# Altium project ECE453-F22-MCU.PrjPcb (part 3 of 3)

## Sheet 06-Lightsensor.SchDoc
size A
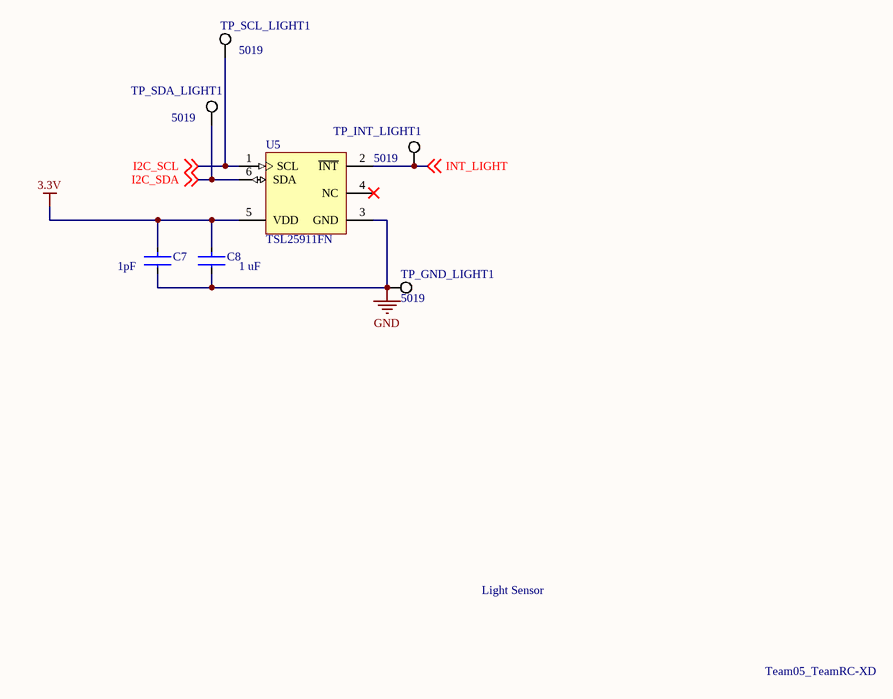
[diagram p4: 06-Lightsensor.SchDoc]

### Parts
C7  Capacitance: 1pF  [FP-CC0805-0_1-0_7-IPC_B]  (hidden comment: CC0805BRNPO9BN1R0)
C8  value 1 uF  [FP-CC0805-0_85-MFG]  (hidden comment: CC0805KKX7R6BB105)
TP_GND_LIGHT1  5019  [KSTN-5019_V]
TP_INT_LIGHT1  5019  [KSTN-5019_V]
TP_SCL_LIGHT1  5019  [KSTN-5019_V]
TP_SDA_LIGHT1  5019  [KSTN-5019_V]
U5  TSL25911FN  [AMS-FN-6-2400X2000DE_V]

### Nets
3.3V: C7.1 C8.1 U5.5(VDD)
GND: C7.2 C8.2 TP_GND_LIGHT1.1 U5.3(GND)
I2C_SCL: TP_SCL_LIGHT1.1 U5.1(SCL) ; off-sheet I2C_SCL
I2C_SDA: TP_SDA_LIGHT1.1 U5.6(SDA) ; off-sheet I2C_SDA
INT_LIGHT: TP_INT_LIGHT1.1 U5.2(~{INT}) ; off-sheet INT_LIGHT

Not connected (* = marked no-connect by the designer): U5 4(NC)*

### Notes on the sheet
- Light Sensor
- Team05_TeamRC-XD

### Library data of the parts
C7 = CMP-03422-001522-1: CAP CER 1PF 50V C0G/NPO 0805; Manufacturer: Yageo; Dielectric: C0G; Case Code (Imperial): 0805; Max Operating Temperature: 125°C; Packaging: Tape and Reel; Min Operating Temperature: -55°C; Weight: 0.000194oz; Resistor Type: Ceramic; Voltage Rating: 50V; Thickness: 0.028inch; Width: 0.049inch; Termination: SMD/SMT; RoHS Compliant: Yes; Length: 0.079inch; Voltage Rating (DC): 50V; Mount: Surface Mount; Height: 0.6mm; Case/Package: 0805; Series: CC; Case Code (Metric): 2012; Depth: 1.25mm; Supplier 1: Digi-Key; Supplier Part Number 1: 311-4124-6-ND; Manufacturer Part Number: CC0805BRNPO9BN1R0; RoHS: Yes; Category: Ceramic Capacitors; Stock 1: 21580; Pricing 1: 1=0.15000, 10=0.10900, 50=0.06180, 100=0.05120, 500=0.03592, 1000=0.02974 (USD); ComponentLink1URL: http://www.mouser.com/ds/2/447/Yageo_UPY-GP_NP0_16V-to-50V_9-358835.pdf?src-supplier=Mouser; ComponentLink1Description: http://www.mouser.com/ds/2/447/Yageo_UPY-GP_NP0_16V-to-50V_9-358835.pdf?src-supplier=Mouser; ComponentLink2URL: https://www.yageo.com/upload/media/product/productsearch/datasheet/mlcc/UPY-GP_NP0_16V-to-50V_18.pdf?src-supplier=Digi-Key; ComponentLink2Description: https://www.yageo.com/upload/media/product/productsearch/datasheet/mlcc/UPY-GP_NP0_16V-to-50V_18.pdf?src-supplier=Digi-Key; ComponentLink3URL: http://www.yageo.com/documents/recent/UPY-GP_NP0_16V-to-50V_16.pdf?src-supplier=Digi-Key; ComponentLink3Description: http://www.yageo.com/documents/recent/UPY-GP_NP0_16V-to-50V_16.pdf?src-supplier=Digi-Key; ComponentLink4URL: http://www.yageo.com/documents/recent/UPY-GP_NP0_16V-to-50V_8.pdf?src-supplier=Avnet; ComponentLink4Description: http://www.yageo.com/documents/recent/UPY-GP_NP0_16V-to-50V_8.pdf?src-supplier=Avnet; ComponentLink5URL: http://www.yageo.com/exep/pages/download/literatures/ProductSelectionGuide%202014_Final_2.pdf?src-supplier=Digi-Key; ComponentLink5Description: http://www.yageo.com/exep/pages/download/literatures/ProductSelectionGuide%202014_Final_2.pdf?src-supplier=Digi-Key
C8 = CMP-03422-000182-1: CAP CER 1UF 10V X7R 0805; Manufacturer: Yageo; Material: Ceramic; Tolerance: 0.1; ComponentLink2URL: http://www.yageo.com/documents/recent/UPY-GPHC_Y5V_6.3V-to-50V_8.pdf; Automotive: No; Temperature Range Low: -30°C; Octopart: https://octopart.com/cc0805kkx7r6bb105-yageo-42522859; Temperature Characteristic: X7R; RoHS: TRUE; Voltage Rating: 10 V; Capacitance: 1 uF; Package: CC0805-0.85; Device Class L3: Ceramic Capacitors; Category: Cap; Mouser Description: Multilayer Ceramic Capacitors MLCC - SMD/SMT 1.0uF 10V X7R 10%; Temperature Range High: +85°C; Ipc Land Pattern Name: CAPC200125X85; Manufacturer Part Number: CC0805KKX7R6BB105; ComponentLink2Description: Datasheet; Temperature: -30°C to +85°C; Height: 0.95mm; Lead Free: Yes; Device Class L1: Passive Components; Device Class L2: Capacitors; Footprint Url: http://www.yageo.com/exep/pages/download/literatures/UPY-C_GEN_24.pdf; Digikey Description: CAP CER 1UF 10V X7R 0805; Supplier 1: Digi-Key; Supplier Part Number 1: 311-1458-2-ND; Stock 1: 126000; Pricing 1: 3000=0.02620, 6000=0.02397, 9000=0.02230, 15000=0.02119, 30000=0.02007, 75000=0.01840 (USD); Mount: Surface Mount; Case/Package: 0805; Number of Pins: 2; Case Code (Imperial): 0805; Case Code (Metric): 2012; Dielectric Material: Ceramic; Min Operating Temperature: -55°C; Max Operating Temperature: 125°C; Dielectric: X7R; Voltage Rating (DC): 10V; Packaging: Tape and Reel; Package Quantity: 1; Termination: SMD/SMT; Resistor Type: Ceramic; Series: CC; Length: 2mm; Width: 1.25mm; Thickness: 0.057inch; Depth: 1.25mm; Radiation Hardening: No; REACH SVHC: Unknown; Halogen Free: Halogen Free; RoHS Compliant: Yes; ComponentLink1URL: https://datasheet.ciiva.com/7978/1489800-7978199.pdf?src-supplier=Element14; ComponentLink1Description: https://datasheet.ciiva.com/7978/1489800-7978199.pdf?src-supplier=Element14; ComponentLink3URL: https://datasheet.ciiva.com/28450/1489800-28450742.pdf?src-supplier=Element14; ComponentLink3Description: https://datasheet.ciiva.com/28450/1489800-28450742.pdf?src-supplier=Element14; ComponentLink4URL: https://datasheet.ciiva.com/46430/1734573-46430165.pdf?src-supplier=Element14; ComponentLink4Description: https://datasheet.ciiva.com/46430/1734573-46430165.pdf?src-supplier=Element14; ComponentLink5URL: https://datasheet.ciiva.com/176/mlccorderingcode-176908.pdf?src-supplier=Digi-Key; ComponentLink5Description: https://datasheet.ciiva.com/176/mlccorderingcode-176908.pdf?src-supplier=Digi-Key; ComponentLink6URL: https://datasheet.ciiva.com/176/mlccorderingcode-176907.pdf?src-supplier=Digi-Key; ComponentLink6Description: https://datasheet.ciiva.com/176/mlccorderingcode-176907.pdf?src-supplier=Digi-Key; ComponentLink7URL: https://datasheet.ciiva.com/176/mlccorderingcode-176909.pdf?src-supplier=Digi-Key; ComponentLink7Description: https://datasheet.ciiva.com/176/mlccorderingcode-176909.pdf?src-supplier=Digi-Key; ComponentLink8URL: https://datasheet.ciiva.com/8033/1489800-8033973.pdf?src-supplier=Element14; ComponentLink8Description: https://datasheet.ciiva.com/8033/1489800-8033973.pdf?src-supplier=Element14; ComponentLink9URL: https://datasheet.ciiva.com/8033/1489800-8033998.pdf?src-supplier=Element14; ComponentLink9Description: https://datasheet.ciiva.com/8033/1489800-8033998.pdf?src-supplier=Element14; ComponentLink10URL: https://datasheet.ciiva.com/13389/upy-gp-np0-16v-to-50v-8-13389349.pdf?src-supplier=Mouser; ComponentLink10Description: https://datasheet.ciiva.com/13389/upy-gp-np0-16v-to-50v-8-13389349.pdf?src-supplier=Mouser; ComponentLink11URL: https://datasheet.ciiva.com/11583/upy-gphc-x7r-6-3v-to-50v-8-11583596.pdf?src-supplier=Avnet; ComponentLink11Description: https://datasheet.ciiva.com/11583/upy-gphc-x7r-6-3v-to-50v-8-11583596.pdf?src-supplier=Avnet
TP_GND_LIGHT1 TP_INT_LIGHT1 TP_SCL_LIGHT1 TP_SDA_LIGHT1 = CMP-1672-00008-1: Test Point, 1 Position SMD, RoHS, Tape and Reel; Manufacturer: Keystone Electronics; ComponentLink1Description: Manufacturer URL; Package Quantity: 1000; DatasheetVersion: 03/2014; Packaging: Tape and Reel; ComponentLink2URL: http://www.keyelco.com/product-pdf.cfm?p=1357; ComponentLink1URL: http://www.keyelco.com/; Mount: Surface Mount; Contact Plating: Silver; PackageDescription: 1-Pin Surface Mount Device, Body 3.81 x 2.03 mm; Pins: 1; RoHSCompliant: True; Mounting Technology: Surface Mount; ComponentLink2Description: Datasheet; PackageReference: 5019; Supplier 1: Digi-Key; Supplier Part Number 1: 36-5019CT-ND; Manufacturer Part Number: 5019; RoHS: Yes; Category: Connectors; Stock 1: 1293364; Pricing 1: 1=0.34000, 25=0.27360, 100=0.22340, 250=0.20064, 500=0.19152 (USD); Number of Pins: 1; Material: Bronze; Contact Material: Bronze; Termination: SMD/SMT; Series: 5019; Height: 0.09inch; REACH SVHC: No SVHC; RoHS Compliant: Yes; Lead Free: Lead Free; ComponentLink3URL: https://datasheet.ciiva.com/16318/m60-2p61-16318395.pdf?src-supplier=Future+Electronics; ComponentLink3Description: https://datasheet.ciiva.com/16318/m60-2p61-16318395.pdf?src-supplier=Future+Electronics; ComponentLink4URL: https://datasheet.ciiva.com/16885/70182998-16885945.pdf?src-supplier=Allied+Electronics; ComponentLink4Description: https://datasheet.ciiva.com/16885/70182998-16885945.pdf?src-supplier=Allied+Electronics; ComponentLink5URL: https://datasheet.ciiva.com/14848/m60-2p61-14848437.pdf?src-supplier=Digi-Key; ComponentLink5Description: https://datasheet.ciiva.com/14848/m60-2p61-14848437.pdf?src-supplier=Digi-Key; ComponentLink6URL: https://datasheet.ciiva.com/14848/m60-2p61-14848438.pdf?src-supplier=Digi-Key; ComponentLink6Description: https://datasheet.ciiva.com/14848/m60-2p61-14848438.pdf?src-supplier=Digi-Key; ComponentLink7URL: https://datasheet.ciiva.com/14848/m60-2p61-14848439.pdf?src-supplier=Digi-Key; ComponentLink7Description: https://datasheet.ciiva.com/14848/m60-2p61-14848439.pdf?src-supplier=Digi-Key
U5 = CMP-0865-00001-1: Light-to-Digital Converter with I2C Interface, 2.7 to 3.6 V, -30 to 70 degC, FN-6, Pb-Free, Reel; Manufacturer: AMS; Interface: I2C - Vdd; Supply Voltage (V): 2.7 - 3.6; Maximum Lux: 88K; Programmable: Gain, Integration Time, Interrupt; Wavelength: 850nm; Data Bus Width: 16b; Max Frequency: 400kHz; Operating Supply Voltage: 3V; ComponentLink2Description: Datasheet; ComponentLink1URL: www.ams.com; Mounting Technology: Surface Mount; PackageReference: FN-6; PackageVersion: TAOS059Q, 11/2009; ComponentLink2URL: http://www.ams.com/eng/content/download/389383/1251117/221235; PartNumber: TSL25911FN; PackageDescription: 6-Pin Dual Flat No-Lead, 2.4 x 2 mm Body, 0.65 mm Pitch; ComponentLink1Description: Manufacturer URL; Supplier 1: Avnet; Supplier Part Number 1: 300150004; Manufacturer Part Number: TSL25911FN; RoHS: Yes; Category: Optical Sensors; Stock 1: 3500; Pricing 1: 3500=1.00640, 7000=0.97920, 14000=0.95200, 21000=0.92480, 28000=0.89760, 35000=0.87040, 350000=0.84320 (USD); Case/Package: WFDFN; Number of Pins: 6; Min Operating Temperature: -30°C; Max Operating Temperature: 70°C; Packaging: Tape and Reel; Package Quantity: 1; Output Type: I2C; Lead Free: Lead Free; RoHS Compliant: Yes; ComponentLink3URL: https://datasheet.ciiva.com/18495/tsl25911-datasheet-en-v1-18495162.pdf?src-supplier=Digi-Key; ComponentLink3Description: https://datasheet.ciiva.com/18495/tsl25911-datasheet-en-v1-18495162.pdf?src-supplier=Digi-Key; ComponentLink4URL: https://datasheet.ciiva.com/26985/tsl2591-v163-5-253098-26985860.pdf?src-supplier=Mouser; ComponentLink4Description: https://datasheet.ciiva.com/26985/tsl2591-v163-5-253098-26985860.pdf?src-supplier=Mouser; ComponentLink5URL: https://datasheet.ciiva.com/26993/tsl25911fn-26993335.pdf?src-supplier=Future+Electronics; ComponentLink5Description: https://datasheet.ciiva.com/26993/tsl25911fn-26993335.pdf?src-supplier=Future+Electronics; ComponentLink6URL: https://datasheet.ciiva.com/18495/tsl2591-datasheet-en-v2-18495163.pdf?src-supplier=Digi-Key; ComponentLink6Description: https://datasheet.ciiva.com/18495/tsl2591-datasheet-en-v2-18495163.pdf?src-supplier=Digi-Key; ComponentLink7URL: https://datasheet.ciiva.com/18495/tsl2591-datasheet-en-v2-18495164.pdf?src-supplier=Digi-Key; ComponentLink7Description: https://datasheet.ciiva.com/18495/tsl2591-datasheet-en-v2-18495164.pdf?src-supplier=Digi-Key

## Sheet 03-Accelerometer_new.SchDoc
size A
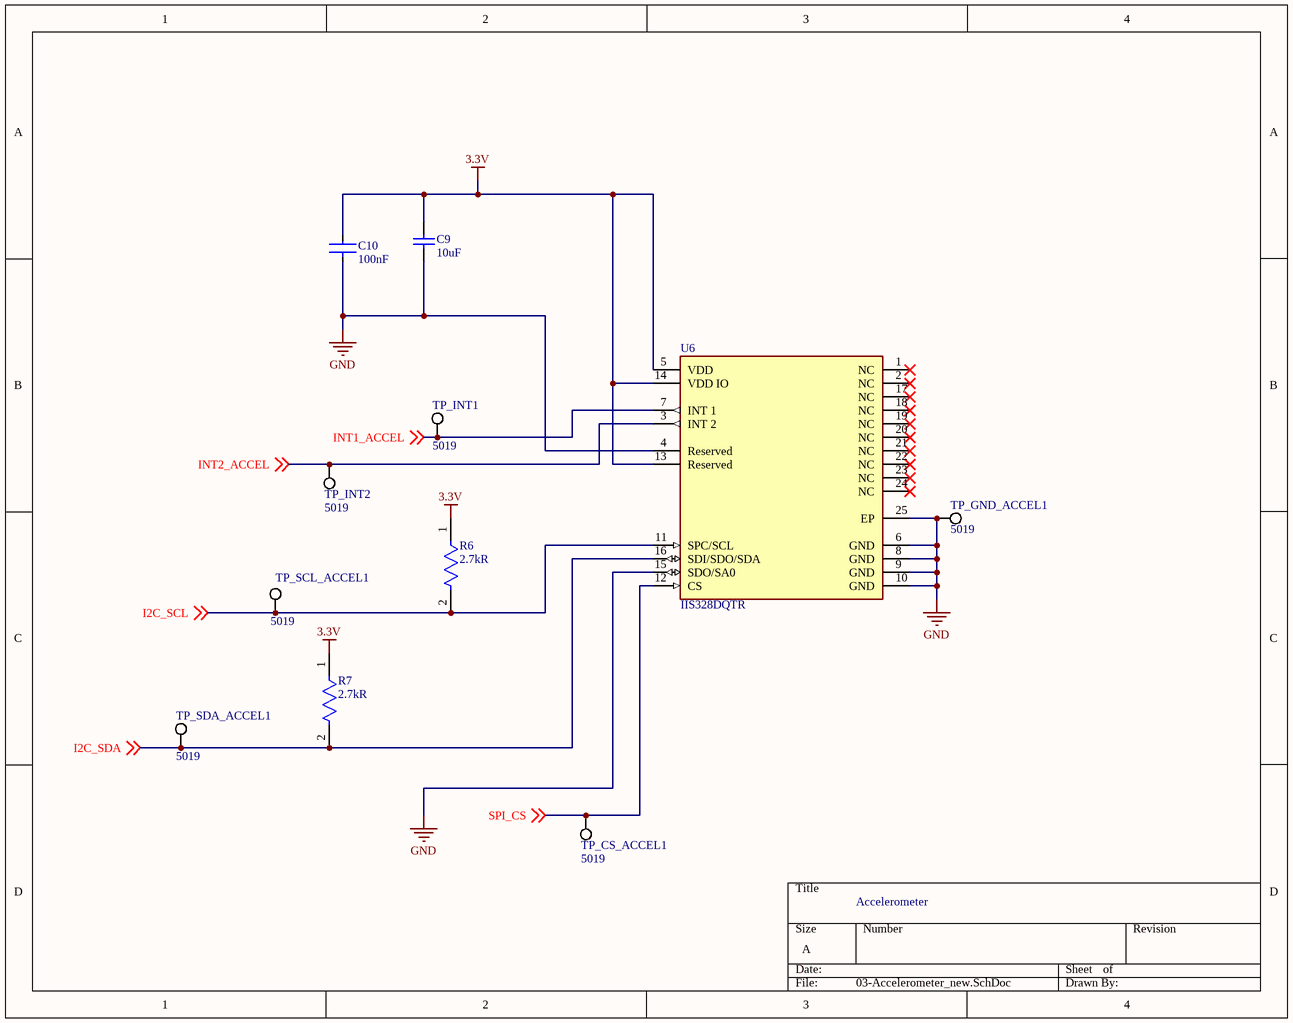
[diagram p5: 03-Accelerometer_new.SchDoc]

### Parts
C9  Capacitance: 10uF  [CAPC2014X150X70LL20]  (hidden comment: TACR106M006RTA)
C10  Capacitance: 100nF  [FP-C2012-125-0_2-MFG]  (hidden comment: C2012X8R1H104K125AA)
R6  Resistance: 2.7kR  [FP-RMCF0805-MFG]  (hidden comment: RMCF0805JT2K70)
R7  Resistance: 2.7kR  [FP-RMCF0805-MFG]  (hidden comment: RMCF0805JT2K70)
TP_CS_ACCEL1  5019  [KSTN-5019_V]
TP_GND_ACCEL1  5019  [KSTN-5019_V]
TP_INT1  5019  [KSTN-5019_V]
TP_INT2  5019  [KSTN-5019_V]
TP_SCL_ACCEL1  5019  [KSTN-5019_V]
TP_SDA_ACCEL1  5019  [KSTN-5019_V]
U6  IIS328DQTR  [FP-IIS328DQTR-MFG]

### Nets
3.3V: C9.1 C10.2 R6.1 R7.1 U6.5(VDD) U6.13(Reserved) U6.14(VDD_IO)
GND: C9.2 C10.1 TP_GND_ACCEL1.1 U6.4(Reserved) U6.6(GND) U6.8(GND) U6.9(GND) U6.10(GND) U6.15(SDO/SA0) U6.25(EP)
I2C_SCL: R6.2 TP_SCL_ACCEL1.1 U6.11(SPC/SCL) ; off-sheet I2C_SCL
I2C_SDA: R7.2 TP_SDA_ACCEL1.1 U6.16(SDI/SDO/SDA) ; off-sheet I2C_SDA
INT1_ACCEL: TP_INT1.1 U6.7(INT_1) ; off-sheet INT1_ACCEL
INT2_ACCEL: TP_INT2.1 U6.3(INT_2) ; off-sheet INT2_ACCEL
SPI_CS: TP_CS_ACCEL1.1 U6.12(CS) ; off-sheet SPI_CS

Not connected (* = marked no-connect by the designer): U6 1(NC)* 2(NC)* 17(NC)* 18(NC)* 19(NC)* 20(NC)* 21(NC)* 22(NC)* 23(NC)* 24(NC)*

### Notes on the sheet
- Accelerometer

### Library data of the parts
C9 = CMP-2007-00024-1: 10 uF Capacitor; Manufacturer: AVX Interconnect / Elco; Dielectric Material: Tantalum; ESR (Equivalent Series Resistance): 5R; Voltage Rating: 6.3V; Tolerance: 20%; Leakage Current: 600nA; Polarity: Polar; Dissipation Factor: 8%; Part Number: TACR106M006RTA; Supplier 1: Digi-Key; Supplier Part Number 1: 478-5225-1-ND; Manufacturer Part Number: TACR106M006RTA; RoHS: Yes; Category: Tantalum Capacitors; Stock 1: 10884; Pricing 1: 1=1.80000, 10=1.45800, 50=1.27280, 100=1.11370, 500=0.84850, 1000=0.74245 (USD); Mount: Surface Mount,PCB; Case/Package: 0805; Number of Pins: 2; Case Code (Imperial): 0805; Case Code (Metric): 2012; Min Operating Temperature: -55°C; Max Operating Temperature: 125°C; Package Quantity: 1; Packaging: Tape and Reel; Voltage Rating (DC): 6.3V; Termination: SMD/SMT; Voltage: 6.3V; Features: General Purpose; Series: TAC; Construction: Flat; Length: 2mm; Width: 1.35mm; Height: 1.35mm; Height - Seated (Max): 0.059inch; Depth: 1.35mm; Lead Pitch: 0.7mm; Radiation Hardening: No; Lead Free: Lead Free; RoHS Compliant: Yes; ComponentLink1URL: https://datasheet.ciiva.com/265/tac-265075.pdf?src-supplier=Digi-Key; ComponentLink1Description: https://datasheet.ciiva.com/265/tac-265075.pdf?src-supplier=Digi-Key; ComponentLink2URL: https://datasheet.ciiva.com/265/tac-265076.pdf?src-supplier=Digi-Key; ComponentLink2Description: https://datasheet.ciiva.com/265/tac-265076.pdf?src-supplier=Digi-Key; ComponentLink3URL: https://datasheet.ciiva.com/265/tac-265077.pdf?src-supplier=Digi-Key; ComponentLink3Description: https://datasheet.ciiva.com/265/tac-265077.pdf?src-supplier=Digi-Key; ComponentLink4URL: https://datasheet.ciiva.com/11244/tac-11244488.pdf?src-supplier=Avnet; ComponentLink4Description: https://datasheet.ciiva.com/11244/tac-11244488.pdf?src-supplier=Avnet; ComponentLink5URL: https://datasheet.ciiva.com/14592/70001310-14592936.pdf?src-supplier=Allied+Electronics; ComponentLink5Description: https://datasheet.ciiva.com/14592/70001310-14592936.pdf?src-supplier=Allied+Electronics
C10 = CMP-08246-005122-1: Multilayer Ceramic Capacitors 100nF ±10% 50V X8R SMD 0805; Manufacturer: TDK; Case/Package: 0805; Dielectric: X8R; Case Code (Metric): 2012; Height: 1.25mm; REACH SVHC: No SVHC; Series: C; Voltage Rating (DC): 50V; Tolerance: 10%; Depth: 1.25mm; Voltage Rating: 50V; Thickness: 0.057inch; RoHS Compliant: Yes; Termination: SMD/SMT; Weight: 0.000194oz; Width: 0.049inch; Mount: Surface Mount; Max Operating Temperature: 150°C; Features: High Temperature; Min Operating Temperature: -55°C; Lead Free: Lead Free; Packaging: Tape and Reel; Resistor Type: Ceramic; Case Code (Imperial): 0805; Package Quantity: 1; Length: 2mm; Supplier 1: Digi-Key; Supplier Part Number 1: 445-2514-6-ND; Manufacturer Part Number: C2012X8R1H104K125AA; RoHS: Yes; Category: Ceramic Capacitors; Stock 1: 681639; Pricing 1: 1=0.18000, 10=0.12600, 50=0.07160, 100=0.05930, 500=0.04158, 1000=0.03443 (USD); Reach SVHC Compliant: No SVHC; ComponentLink1URL: https://datasheet.ciiva.com/24216/c2012x8r1h104k125aa-265043-24216015.pdf?src-supplier=Mouser; ComponentLink1Description: https://datasheet.ciiva.com/24216/c2012x8r1h104k125aa-265043-24216015.pdf?src-supplier=Mouser; ComponentLink2URL: https://datasheet.ciiva.com/28451/1833282-28451948.pdf?src-supplier=Element14; ComponentLink2Description: https://datasheet.ciiva.com/28451/1833282-28451948.pdf?src-supplier=Element14; ComponentLink3URL: https://datasheet.ciiva.com/22719/1833282-22719557.pdf?src-supplier=Element14; ComponentLink3Description: https://datasheet.ciiva.com/22719/1833282-22719557.pdf?src-supplier=Element14; ComponentLink4URL: https://datasheet.ciiva.com/46384/e417-c-46384149.pdf?src-supplier=Element14; ComponentLink4Description: https://datasheet.ciiva.com/46384/e417-c-46384149.pdf?src-supplier=Element14
R6 R7 = CMP-26527-006669-1: 2.7kΩ ±5% 0.125W 0805 Thick Film Chip Resistor AEC-Q200 compliant; Manufacturer: Stackpole Electronics; Temperature Coefficient: 100ppm/°C; Max Power Dissipation: 125mW; Depth: 1.25mm; Length: 0.079inch; Size Code: 0805; RoHS Compliant: Yes; Mount: Surface Mount; Contact Plating: Tin; Construction: Rectangular; Height: 0.026inch; Number of Terminations: 2; Lead Free: Lead Free; Case Code (Metric): 2012; Radiation Hardening: No; Width: 0.049inch; Max Operating Temperature: 155°C; Series: RMCF; Power Rating: 125mW; Military Standard: Not; Resistor Type: Thick Film; Package Quantity: 1; Tolerance: 5%; Features: Automotive AEC-Q200; Packaging: Tape and Reel; Min Operating Temperature: -55°C; Case/Package: 0805; Case Code (Imperial): 0805; Supplier 1: Digi-Key; Supplier Part Number 1: RMCF0805JT2K70CT-ND; Manufacturer Part Number: RMCF0805JT2K70; RoHS: Yes; Category: Chip SMD Resistors; Stock 1: 162420; Pricing 1: 1=0.10000, 10=0.01800, 100=0.00730, 1000=0.00328, 2500=0.00284 (USD); ComponentLink1URL: https://datasheet.ciiva.com/26946/getdatasheetpartid-362051-26946720.pdf?src-supplier=Verical; ComponentLink1Description: https://datasheet.ciiva.com/26946/getdatasheetpartid-362051-26946720.pdf?src-supplier=Verical
TP_CS_ACCEL1 TP_GND_ACCEL1 TP_INT1 TP_INT2 TP_SCL_ACCEL1 TP_SDA_ACCEL1 = CMP-1672-00008-1: as TP_GND_LIGHT1 on sheet 06-Lightsensor; ComponentLink1Description: Manufacturer URL; Package Quantity: 1000; DatasheetVersion: 03/2014; Packaging: Tape and Reel; ComponentLink2URL: http://www.keyelco.com/product-pdf.cfm?p=1357; ComponentLink1URL: http://www.keyelco.com/; Mount: Surface Mount; Contact Plating: Silver; PackageDescription: 1-Pin Surface Mount Device, Body 3.81 x 2.03 mm; Pins: 1; RoHSCompliant: True; Mounting Technology: Surface Mount; ComponentLink2Description: Datasheet; PackageReference: 5019; Supplier 1: Newark; Supplier Part Number 1: 06W4636; Manufacturer Part Number: 5019; RoHS: Yes; Category: Connectors; Stock 1: 109000; Pricing 1: 1=0.12300, 1000=0.12300, 2000=0.11700, 4000=0.11300, 6000=0.11000 (USD); Number of Pins: 1; Material: Bronze; Contact Material: Bronze; Termination: SMD/SMT; Series: 5019; Height: 0.09inch; REACH SVHC: No SVHC; RoHS Compliant: Yes; Lead Free: Lead Free; ComponentLink3URL: https://datasheet.ciiva.com/16318/m60-2p61-16318395.pdf?src-supplier=Future+Electronics; ComponentLink3Description: https://datasheet.ciiva.com/16318/m60-2p61-16318395.pdf?src-supplier=Future+Electronics; ComponentLink4URL: https://datasheet.ciiva.com/16885/70182998-16885945.pdf?src-supplier=Allied+Electronics; ComponentLink4Description: https://datasheet.ciiva.com/16885/70182998-16885945.pdf?src-supplier=Allied+Electronics; ComponentLink5URL: https://datasheet.ciiva.com/14848/m60-2p61-14848437.pdf?src-supplier=Digi-Key; ComponentLink5Description: https://datasheet.ciiva.com/14848/m60-2p61-14848437.pdf?src-supplier=Digi-Key; ComponentLink6URL: https://datasheet.ciiva.com/14848/m60-2p61-14848438.pdf?src-supplier=Digi-Key; ComponentLink6Description: https://datasheet.ciiva.com/14848/m60-2p61-14848438.pdf?src-supplier=Digi-Key; ComponentLink7URL: https://datasheet.ciiva.com/14848/m60-2p61-14848439.pdf?src-supplier=Digi-Key; ComponentLink7Description: https://datasheet.ciiva.com/14848/m60-2p61-14848439.pdf?src-supplier=Digi-Key
U6 = CMP-12175-000005-1: ACCELEROMETER 2-8G I2C/SPI 24QFN; Manufacturer: STMicroelectronics; Accel Range: 2/4/8g; Accel Resolution: 16bits; Standoff Height: 0mm; Operating Supply Current: 250uA; Min Supply Voltage: 1.71V; Accel Axis: X+Y and Z; Sensor Output: I2C,SPI; Max Supply Voltage: 3.7V; Bandwidth: 500Hz; Output Type: SPI,I2C; Axis: X, Y, Z; Device Class L2: Motion Sensors; Temperature: -40°C to +105°C; Digikey Description: ACCELEROMETER 2-8G I2C/SPI 24QFN; Device Class L3: Accelerometers; ComponentLink2URL: https://www.st.com/content/ccc/resource/technical/document/datasheet/24/b9/50/c5/61/ae/4d/58/DM00150114.pdf/files/DM00150114.pdf/jcr:content/translations/en.DM00150114.pdf; Automotive: No; Octopart: https://octopart.com/iis328dqtr-stmicroelectronics-58187312; Device Class L1: Sensors; Package: 0; Ipc Land Pattern Name: QFN50P400X400X180-24; Category: IC; Height: 1.85mm; ComponentLink2Description: Datasheet; Temperature Range High: +105°C; Lead Free: Yes; Manufacturer Part Number: IIS328DQTR; Temperature Range Low: -40°C; RoHS: TRUE; Supplier 1: Newark; Supplier Part Number 1: 83Y4299; Stock 1: 15167; Pricing 1: 1=6.14000, 10=5.52000, 25=5.22000, 50=4.87000, 100=4.53000, 250=4.34000, 500=3.54000 (USD); Mount: Surface Mount; Case/Package: QFN; Number of Pins: 24; Min Operating Temperature: -40°C; Max Operating Temperature: 105°C; Packaging: Cut Tape; Reach SVHC Compliant: No SVHC; ComponentLink1URL: http://www.farnell.com/datasheets/2028146.pdf?src-supplier=Farnell; ComponentLink1Description: http://www.farnell.com/datasheets/2028146.pdf?src-supplier=Farnell; ComponentLink3URL: http://www.st.com/st-web-ui/static/active/en/resource/technical/document/datasheet/DM00150114.pdf?src-supplier=Avnet; ComponentLink3Description: http://www.st.com/st-web-ui/static/active/en/resource/technical/document/datasheet/DM00150114.pdf?src-supplier=Avnet; ComponentLink4URL: http://www.st.com/content/ccc/resource/technical/document/datasheet/24/b9/50/c5/61/ae/4d/58/DM00150114.pdf/files/DM00150114.pdf/jcr:content/translations/en.DM00150114.pdf?src-supplier=Digi-Key; ComponentLink4Description: http://www.st.com/content/ccc/resource/technical/document/datasheet/24/b9/50/c5/61/ae/4d/58/DM00150114.pdf/files/DM00150114.pdf/jcr:content/translations/en.DM00150114.pdf?src-supplier=Digi-Key; ComponentLink5URL: http://www.farnell.com/datasheets/2028146.pdf?src-supplier=Newark; ComponentLink5Description: http://www.farnell.com/datasheets/2028146.pdf?src-supplier=Newark; ComponentLink6URL: http://www.farnell.com/datasheets/2028146.pdf?src-supplier=Element14; ComponentLink6Description: http://www.farnell.com/datasheets/2028146.pdf?src-supplier=Element14

## Nets that join several sheets
3.3V: 02-MCU (12 pins), 04-GPS (5 pins), 05-Power (5 pins), 06-Lightsensor (C7.1 C8.1 U5.5), 03-Accelerometer_new (7 pins)
GND: 02-MCU (18 pins), 04-GPS (12 pins), 05-Power (11 pins), 06-Lightsensor (C7.2 C8.2 TP_GND_LIGHT1.1 U5.3), 03-Accelerometer_new (10 pins)
3V3_IN_LED: 02-MCU (U200.1), 05-Power (LED1.2 TP_AFTER_SUPRVSR_3V3.1 U3.3)
I2C_SCL: 02-MCU (MD200.24), 06-Lightsensor (TP_SCL_LIGHT1.1 U5.1), 03-Accelerometer_new (R6.2 TP_SCL_ACCEL1.1 U6.11)
I2C_SDA: 02-MCU (MD200.29), 06-Lightsensor (TP_SDA_LIGHT1.1 U5.6), 03-Accelerometer_new (R7.2 TP_SDA_ACCEL1.1 U6.16)
INT1_ACCEL: 02-MCU (MD200.23), 03-Accelerometer_new (TP_INT1.1 U6.7)
INT2_ACCEL: 02-MCU (MD200.22), 03-Accelerometer_new (TP_INT2.1 U6.3)
INT_LIGHT: 02-MCU (MD200.31), 06-Lightsensor (TP_INT_LIGHT1.1 U5.2)
SPI_CS: 02-MCU (MD200.9), 03-Accelerometer_new (TP_CS_ACCEL1.1 U6.12)
UART_RX: 02-MCU (MD200.40), 04-GPS (TP_GPS_TX1.1 U1.4)
UART_TX: 02-MCU (MD200.39), 04-GPS (TP_GPS_RX1.1 U1.5)